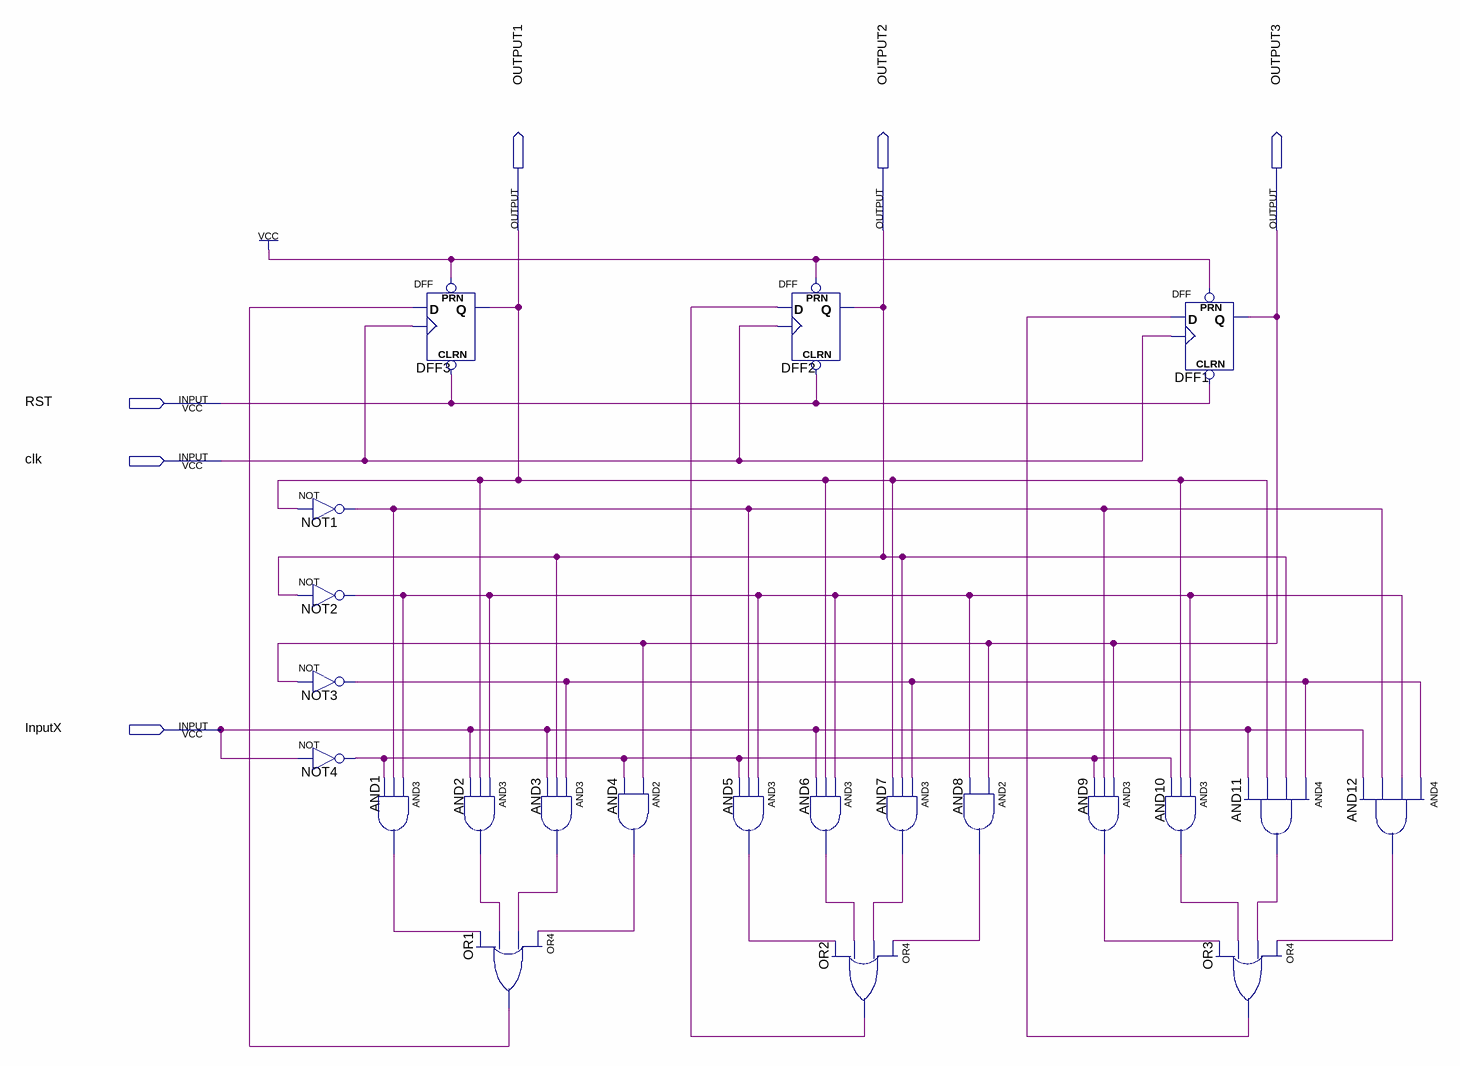
[diagram p0: schematic sheet]
// Quartus schematic Counter.bdf as structural Verilog: 22 symbols, 6 pins
module Counter (
  input  RST,
  input  clk,
  input  InputX,
  output OUTPUT1,
  output OUTPUT2,
  output OUTPUT3
);

  wire AND1_out, AND2_out, AND3_out, AND4_out, AND5_out, AND6_out, AND7_out, AND8_out, AND9_out, AND10_out,
       AND11_out, AND12_out, NOT1_out, NOT2_out, NOT3_out, NOT4_out, OR1_out, OR2_out, OR3_out;

  not NOT1 (NOT1_out, OUTPUT1);
  not NOT2 (NOT2_out, OUTPUT2);
  not NOT3 (NOT3_out, OUTPUT3);
  not NOT4 (NOT4_out, InputX);
  DFF DFF3 (.CLRN(RST), .CLK(clk), .D(OR1_out), .PRN(1'b1), .Q(OUTPUT1));
  and AND1 (AND1_out, NOT2_out, NOT1_out, NOT4_out);
  and AND2 (AND2_out, NOT2_out, OUTPUT1, InputX);
  or OR1 (OR1_out, AND4_out, AND3_out, AND2_out, AND1_out);
  and AND3 (AND3_out, NOT3_out, OUTPUT2, InputX);
  and AND4 (AND4_out, OUTPUT3, NOT4_out);
  and AND5 (AND5_out, NOT2_out, NOT1_out, NOT4_out);
  DFF DFF2 (.CLRN(RST), .CLK(clk), .D(OR2_out), .PRN(1'b1), .Q(OUTPUT2));
  and AND6 (AND6_out, NOT2_out, OUTPUT1, InputX);
  and AND7 (AND7_out, NOT3_out, OUTPUT2, OUTPUT1);
  or OR2 (OR2_out, AND8_out, AND7_out, AND6_out, AND5_out);
  and AND8 (AND8_out, OUTPUT3, NOT2_out);
  and AND9 (AND9_out, OUTPUT3, NOT1_out, NOT4_out);
  DFF DFF1 (.CLRN(RST), .CLK(clk), .D(OR3_out), .PRN(1'b1), .Q(OUTPUT3));
  and AND10 (AND10_out, NOT2_out, OUTPUT1, NOT4_out);
  and AND11 (AND11_out, NOT3_out, OUTPUT2, OUTPUT1, InputX);
  or OR3 (OR3_out, AND12_out, AND11_out, AND10_out, AND9_out);
  and AND12 (AND12_out, NOT3_out, NOT2_out, NOT1_out, InputX);
endmodule
